# Altium schematic sheet Misc_switches.SchDoc: RP2040 CNC
size B; Author: AM; CompanyName: Expatria Technologies; DrawnBy: A.Marles; Engineer: AM; Organization: Expatria Technolgoies; DocumentNumber: 8; SheetNumber: 8; SheetTotal: 14
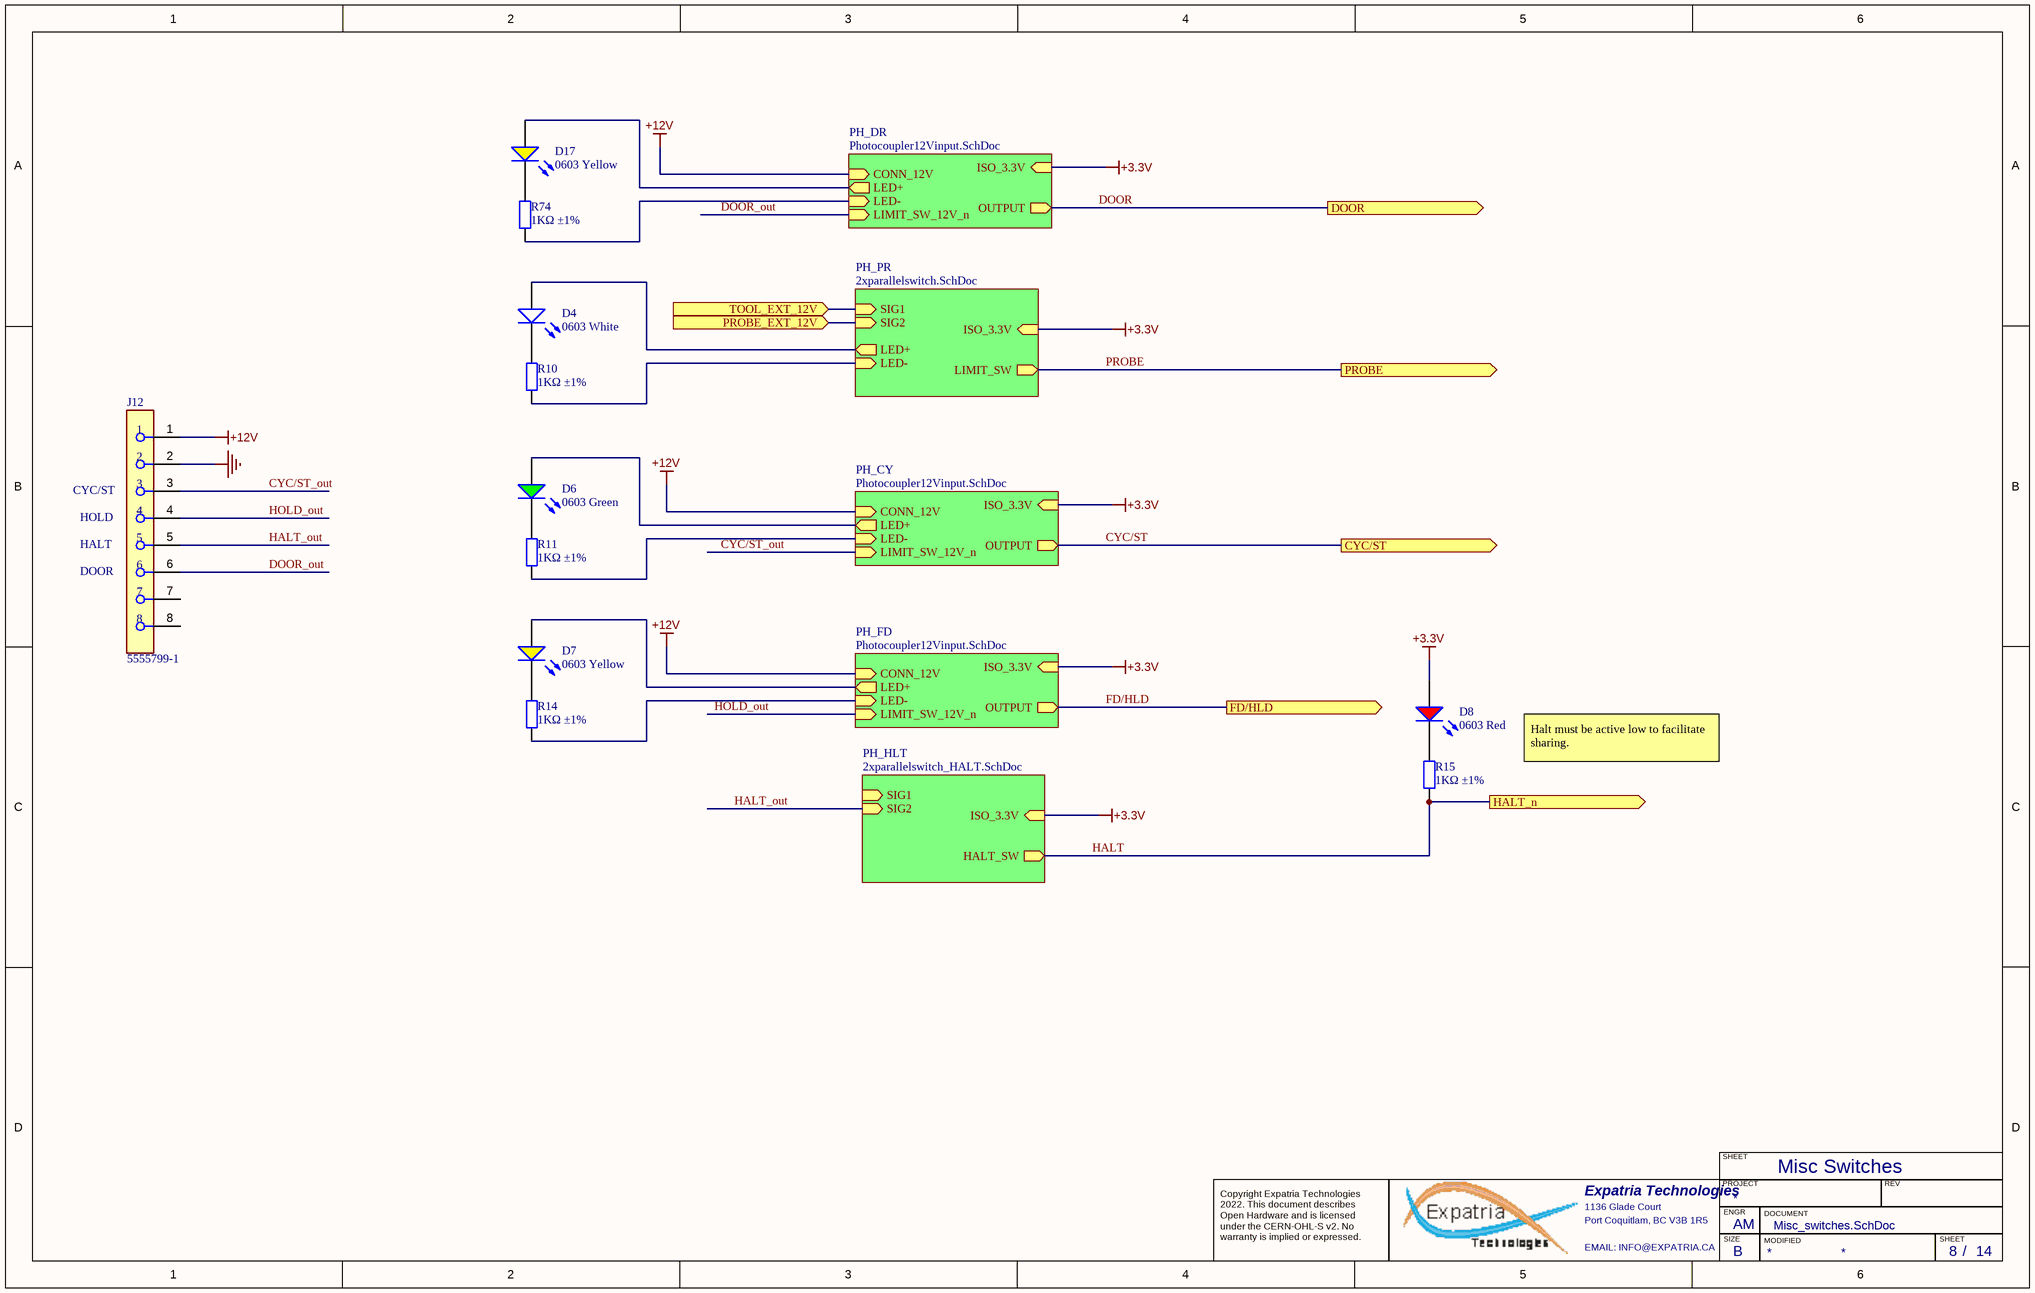
[diagram p0: Misc_switches.SchDoc]

## Parts
D4  0603 White  [0603_LED_S1]
D6  0603 Green  [0603_LED_S1]
D7  0603 Yellow  [0603_LED_S1]
D8  0603 Red  [0603_LED_S1]
D17  0603 Yellow  [0603_LED_S1]
J12  5555799-1  [FP-5555799-1-MFG]
R10  1KΩ ±1%  [0603_R]
R11  1KΩ ±1%  [0603_R]
R14  1KΩ ±1%  [0603_R]
R15  1KΩ ±1%  [0603_R]
R74  1KΩ ±1%  [0603_R]

## Sub-sheets
PH_CY = Photocoupler12Vinput.SchDoc: OUTPUT (out), LED- (in), LED+ (out), CONN_12V (in), ISO_3.3V (in), LIMIT_SW_12V_n (in)
PH_DR = Photocoupler12Vinput.SchDoc: OUTPUT (out), LED+ (out), LED- (in), CONN_12V (in), ISO_3.3V (in), LIMIT_SW_12V_n (in)
PH_FD = Photocoupler12Vinput.SchDoc: OUTPUT (out), LED+ (out), LED- (in), CONN_12V (in), ISO_3.3V (in), LIMIT_SW_12V_n (in)
PH_HLT = 2xparallelswitch_HALT.SchDoc: ISO_3.3V (in), SIG1 (in), SIG2 (in), HALT_SW (out)
PH_PR = 2xparallelswitch.SchDoc: LIMIT_SW (out), LED+ (out), ISO_3.3V (in), LED- (in), SIG1 (in), SIG2 (in)

## Ports
CYC/ST (out), DOOR (out), FD/HLD (out), HALT_n (out), PROBE (out), PROBE_EXT_12V (in), TOOL_EXT_12V (in)

## Nets
+3.3V: D8.A ; sheet PH_CY/ISO_3.3V, sheet PH_FD/ISO_3.3V, sheet PH_DR/ISO_3.3V, sheet PH_PR/ISO_3.3V, sheet PH_HLT/ISO_3.3V
+12V: J12.1 ; sheet PH_CY/CONN_12V, sheet PH_FD/CONN_12V, sheet PH_DR/CONN_12V
GND: J12.2
CYC/ST: port CYC/ST, sheet PH_CY/OUTPUT
CYC/ST_out: J12.3 ; sheet PH_CY/LIMIT_SW_12V_n
DOOR: port DOOR, sheet PH_DR/OUTPUT
DOOR_out: J12.6 ; sheet PH_DR/LIMIT_SW_12V_n
FD/HLD: port FD/HLD, sheet PH_FD/OUTPUT
HALT: R15.2 ; port HALT_n, sheet PH_HLT/HALT_SW
HALT_out: J12.5 ; sheet PH_HLT/SIG2
HOLD_out: J12.4 ; sheet PH_FD/LIMIT_SW_12V_n
PROBE: port PROBE, sheet PH_PR/LIMIT_SW
PROBE_EXT_12V: port PROBE_EXT_12V, sheet PH_PR/SIG2
TOOL_EXT_12V: port TOOL_EXT_12V, sheet PH_PR/SIG1
NetD4_A: D4.A ; sheet PH_PR/LED+
NetD4_K: D4.K R10.1
NetD6_A: D6.A ; sheet PH_CY/LED+
NetD6_K: D6.K R11.1
NetD7_A: D7.A ; sheet PH_FD/LED+
NetD7_K: D7.K R14.1
NetD8_K: D8.K R15.1
NetD17_A: D17.A ; sheet PH_DR/LED+
NetD17_K: D17.K R74.1
NetR10_2: R10.2 ; sheet PH_PR/LED-
NetR11_2: R11.2 ; sheet PH_CY/LED-
NetR14_2: R14.2 ; sheet PH_FD/LED-
NetR74_2: R74.2 ; sheet PH_DR/LED-

Not connected (* = marked no-connect by the designer): J12 7 8

## Notes on the sheet
- (near J12) CYC/ST
- (near J12) HOLD
- (near J12) HALT
- (near J12) DOOR
- Halt must be active low to facilitate sharing.
- Misc Switches
- SHEET
- Expatria Technologies
- 1136 Glade Court
- Port Coquitlam, BC V3B 1R5
- PROJECT
- SIZE
- ENGR
- MODIFIED
- DOCUMENT
- REV
- Copyright Expatria Technologies 2022. This document describes Open Hardware and is licensed under the CERN-OHL-S v2. No warranty is implied or expressed.
- EMAIL: INFO@EXPATRIA.CA
- B
- /

## Library data of the parts
D4 = 0603 LED White: LED; ComponentLink1Description: 供应商链接; ComponentLink1URL: http://www.szlcsc.com/product/details_2663.html; Package: 0603; Supplier: LC; SuppliersPartNumber: C2290; Color: White
D6 = 0603 LED Green: LED; ComponentLink1Description: 供应商链接; ComponentLink1URL: http://www.szlcsc.com/product/details_73152.html; Package: 0603; Supplier: LC; SuppliersPartNumber: C72043; Color: Green
D7 D17 = 0603 LED Yellow: LED; ComponentLink1Description: 供应商链接; ComponentLink1URL: http://www.szlcsc.com/product/details_73147.html; Package: 0603; Supplier: LC; SuppliersPartNumber: C72038; Color: Yellow
D8 = 0603 LED Red: LED; ComponentLink1Description: 供应商链接; ComponentLink1URL: http://www.szlcsc.com/product/details_2659.html; Package: 0603; Supplier: LC; SuppliersPartNumber: C2286; Color: Red
J12 = CMP-03371-000003-1: CONN MOD JACK 8P8C VERT UNSHLD; Manufacturer: TE Connectivity; Pitch: 2.54mm; Number Of Contacts: 8; Is Female: yes; Device Class L3: unset; Manufacturer Part Number: 5555799-1; Temperature Range High: +85°C; Temperature Range Low: -40°C; Octopart: https://octopart.com/5555799-1-te+connectivity-39526335; Device Class L1: Connectors; Device Class L2: Modular / Ethernet Connectors; Mouser Description: Conn RJ-45 F 8 POS 2.54mm Solder ST Thru-Hole 8 Terminal 1 Port Cat 3 Box/Package/Tray; Digikey Description: CONN MOD JACK 8P8C VERT UNSHLD; Package: 5555799-1; Temperature: -40°C to +85°C; SuppliersPartNumber: C305983
R10 R11 R14 R15 R74 = 0603 1K (1001) 1%: Chip resistor; Manufacturer: Uniroyal Elec; PartNumber: 0603WAF1001T5E; Power: 1/10W; ComponentLink1Description: Supplier link; ComponentLink1URL: http://www.szlcsc.com/product/details_21904.html; Package: 0603; Supplier: LC; SuppliersPartNumber: C21190; Resistance: 1KΩ; Tolerance: 1%